# Altium schematic sheet schematic.SchDoc
size A4; SheetNumber: 1; SheetTotal: 5
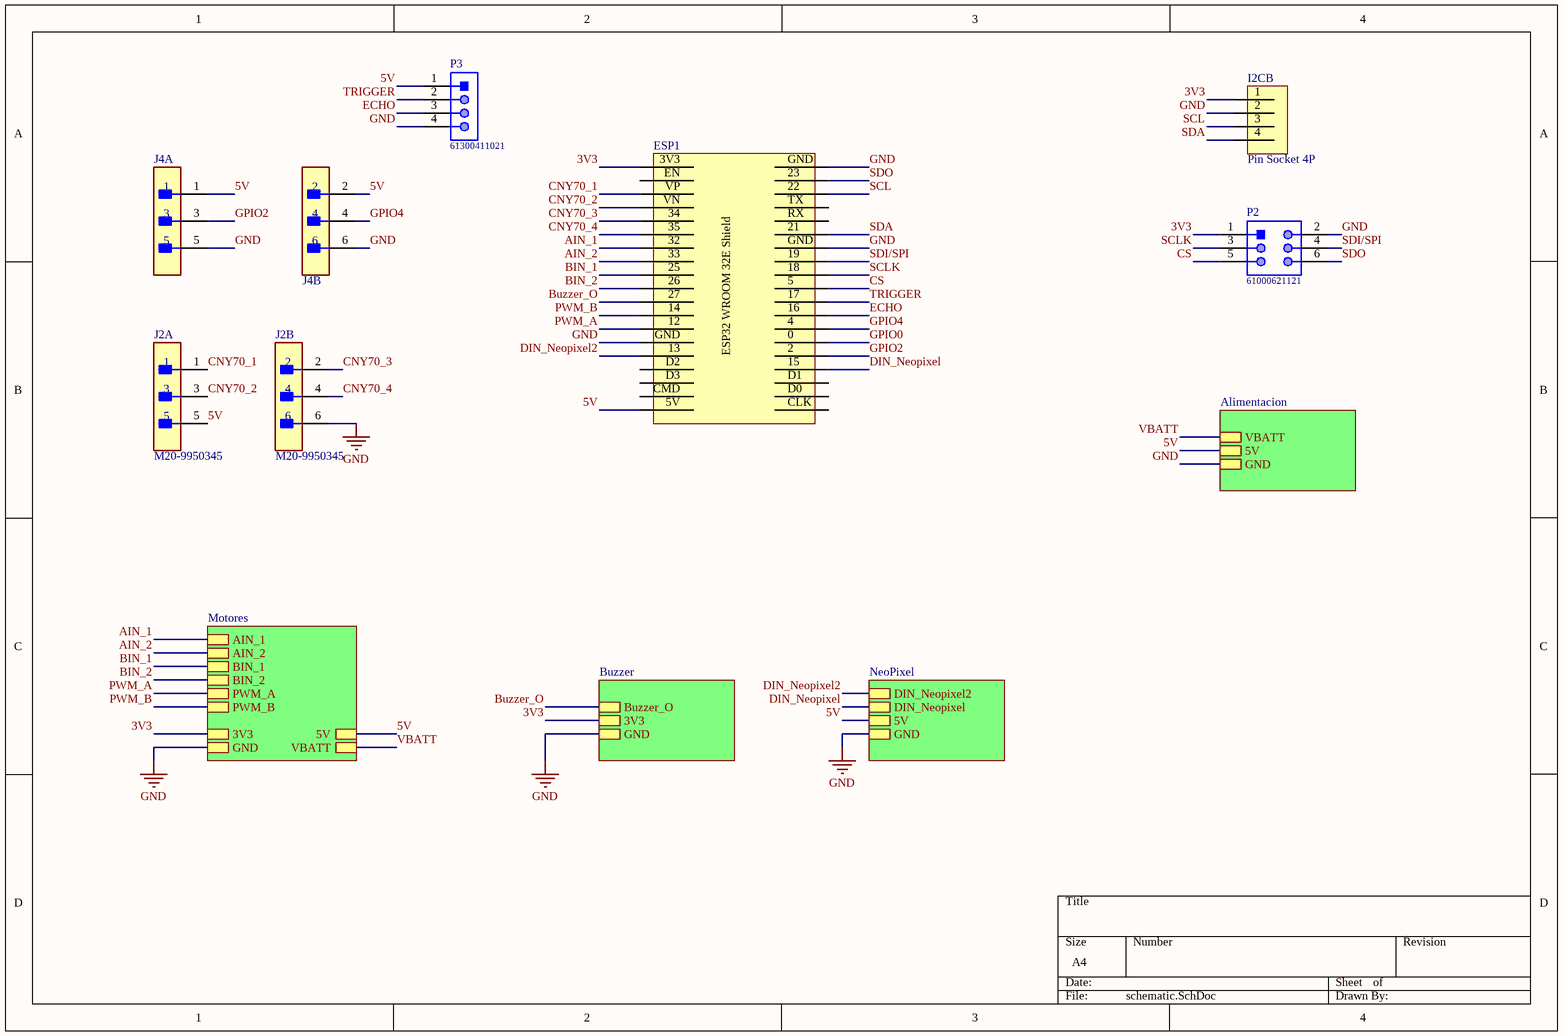
[diagram p0: schematic.SchDoc]

## Parts
ESP1  Shield_ESP32_WR32E  [Shield_ESP32_WR32E]  (value not drawn)
I2C  Pin Socket 4P  [Pin Socket 4P]  (part B of 2)
J2  M20-9950345  [FP-M20-9950345-MFG]  (parts A,B of 2)
J4  M20-9950345  [FP-M20-9950345-MFG]  (value not drawn)  (parts A,B of 2)
P2  61000621121  [61000621121]
P3  61300411021  [61300411021]

## Sub-sheets
Alimentacion = Alimentacion.SchDoc: VBATT, GND, 5V
Buzzer = Buzzer.SchDoc: GND, 3V3, Buzzer_O
Motores = Motores.SchDoc: AIN_1, BIN_1, GND, AIN_2, PWM_B, 3V3, PWM_A, BIN_2, 5V, VBATT
NeoPixel = NeoPixel.SchDoc: DIN_Neopixel, GND, 5V, DIN_Neopixel2

## Nets
GND: ESP1.GND I2C.2 J2.6 J4.5 J4.6 P2.2 P3.4 ; sheet NeoPixel/GND, sheet Buzzer/GND, sheet Motores/GND, sheet Alimentacion/GND
3V3: ESP1.3V3 I2C.1 P2.1 ; sheet Buzzer/3V3, sheet Motores/3V3
5V: ESP1.5V J2.5 J4.1 J4.2 P3.1 ; sheet NeoPixel/5V, sheet Motores/5V, sheet Alimentacion/5V
AIN_1: ESP1.32 ; sheet Motores/AIN_1
AIN_2: ESP1.33 ; sheet Motores/AIN_2
BIN_1: ESP1.25 ; sheet Motores/BIN_1
BIN_2: ESP1.26 ; sheet Motores/BIN_2
Buzzer_O: ESP1.27 ; sheet Buzzer/Buzzer_O
CNY70_1: ESP1.VP J2.1
CNY70_2: ESP1.VN J2.3
CNY70_3: ESP1.34 J2.2
CNY70_4: ESP1.35 J2.4
CS: ESP1.5 P2.5
DIN_Neopixel: ESP1.15 ; sheet NeoPixel/DIN_Neopixel
DIN_Neopixel2: ESP1.13 ; sheet NeoPixel/DIN_Neopixel2
ECHO: ESP1.16 P3.3
GPIO0: ESP1.0
GPIO2: ESP1.2 J4.3
GPIO4: ESP1.4 J4.4
PWM_A: ESP1.12 ; sheet Motores/PWM_A
PWM_B: ESP1.14 ; sheet Motores/PWM_B
SCL: ESP1.22 I2C.3
SCLK: ESP1.18 P2.3
SDA: ESP1.21 I2C.4
SDI/SPI: ESP1.19 P2.4
SDO: ESP1.23 P2.6
TRIGGER: ESP1.17 P3.2
VBATT: sheet Motores/VBATT, sheet Alimentacion/VBATT

Not connected (* = marked no-connect by the designer): ESP1 CLK CMD D0 D1 D2 D3 EN RX TX

## Notes on the sheet
- (in symbol Shield_ESP32_WR32E) ESP32 WROOM 32E Shield

## Library data of the parts
I2C = Pin Socket 4P: Female Header 4 1 Straight，180degrees 2.54mm Through Hole,P=2.54mm Pin Header & Female Header RoHS
J2 J4 = CMP-15831-000002-1: CONN HEADER R/A 6POS 2.54MM; Manufacturer: Harwin; Conn Gender: Male; Number Of Contacts: 6; Conn Orientation: Right Angle; Current Rating: 3A; Device Class L2: Headers and Wire Housings; Temperature: -40°C to +105°C; Device Class L1: Connectors; RoHS: TRUE; Temperature Range Low: -40°C; ComponentLink2URL: https://cdn.harwin.com/pdfs/M20-995.pdf; Height: 5.28mm; Digikey Description: CONN HEADER R/A 6POS 2.54MM; Pitch: 2.54mm; Manufacturer Part Number: M20-9950345; Device Class L3: unset; Ipc Land Pattern Name: DFN400X400X80-14; Automotive: No; Octopart: https://octopart.com/m20-9950345-harwin-21265213; Category: Conn; Mouser Description: Headers & Wire Housings 03+03 DIL HORIZONTAL PIN HEADER GOLD HT; Package: 0; Number Of Rows: 2; Contact Material: Gold,Nickel; Lead Free: Yes; ComponentLink2Description: Datasheet; Temperature Range High: +105°C
P2 = CMP-1502-01024-1: SMT Vertical Pin Header WR-PHD, Pitch 2.54 mm, Dual Row, 6 pins; Manufacturer: Wurth Elektronik; Withstanding Voltage: 500VAC; Contact Resistance: 20mOhm; Working Voltage: 250VAC; Gender: Male; Rated Current: 3A; Pin Number: 6; Pitch: 2.54mm; Part Number: 61000621121; Operating Temperature: -40to125degC; Mounting Technology: SMT; Packaging: Tube; Datasheet URL: https://katalog.we-online.de/em/datasheet/6100xx21121.pdf; Package Reference: 61000621121; Publisher: WurthElektronik; Row Number: Dual; Orientation: Vertical; Manufacturer URL: http://www.we-online.de
P3 = CMP-1502-01063-1: THT Angled Pin Header WR-PHD, Pitch 2.54 mm, Single Row, 4 pins; Manufacturer: Wurth Elektronik; Gender: Male; Pin Number: 4; Withstanding Voltage: 500VAC; Working Voltage: 250VAC; Contact Resistance: 20mOhm; Pitch: 2.54mm; Rated Current: 3A; Manufacturer URL: http://www.we-online.de; Mounting Technology: THT; Publisher: WurthElektronik; Operating Temperature: -40to105degC; Packaging: Bag; Row Number: Single; Package Reference: 61300411021; Part Number: 61300411021; Orientation: Angled; Datasheet URL: https://katalog.we-online.de/em/datasheet/6130xx11021.pdf